# EAGLE design ui (EAGLE 9.6.2)
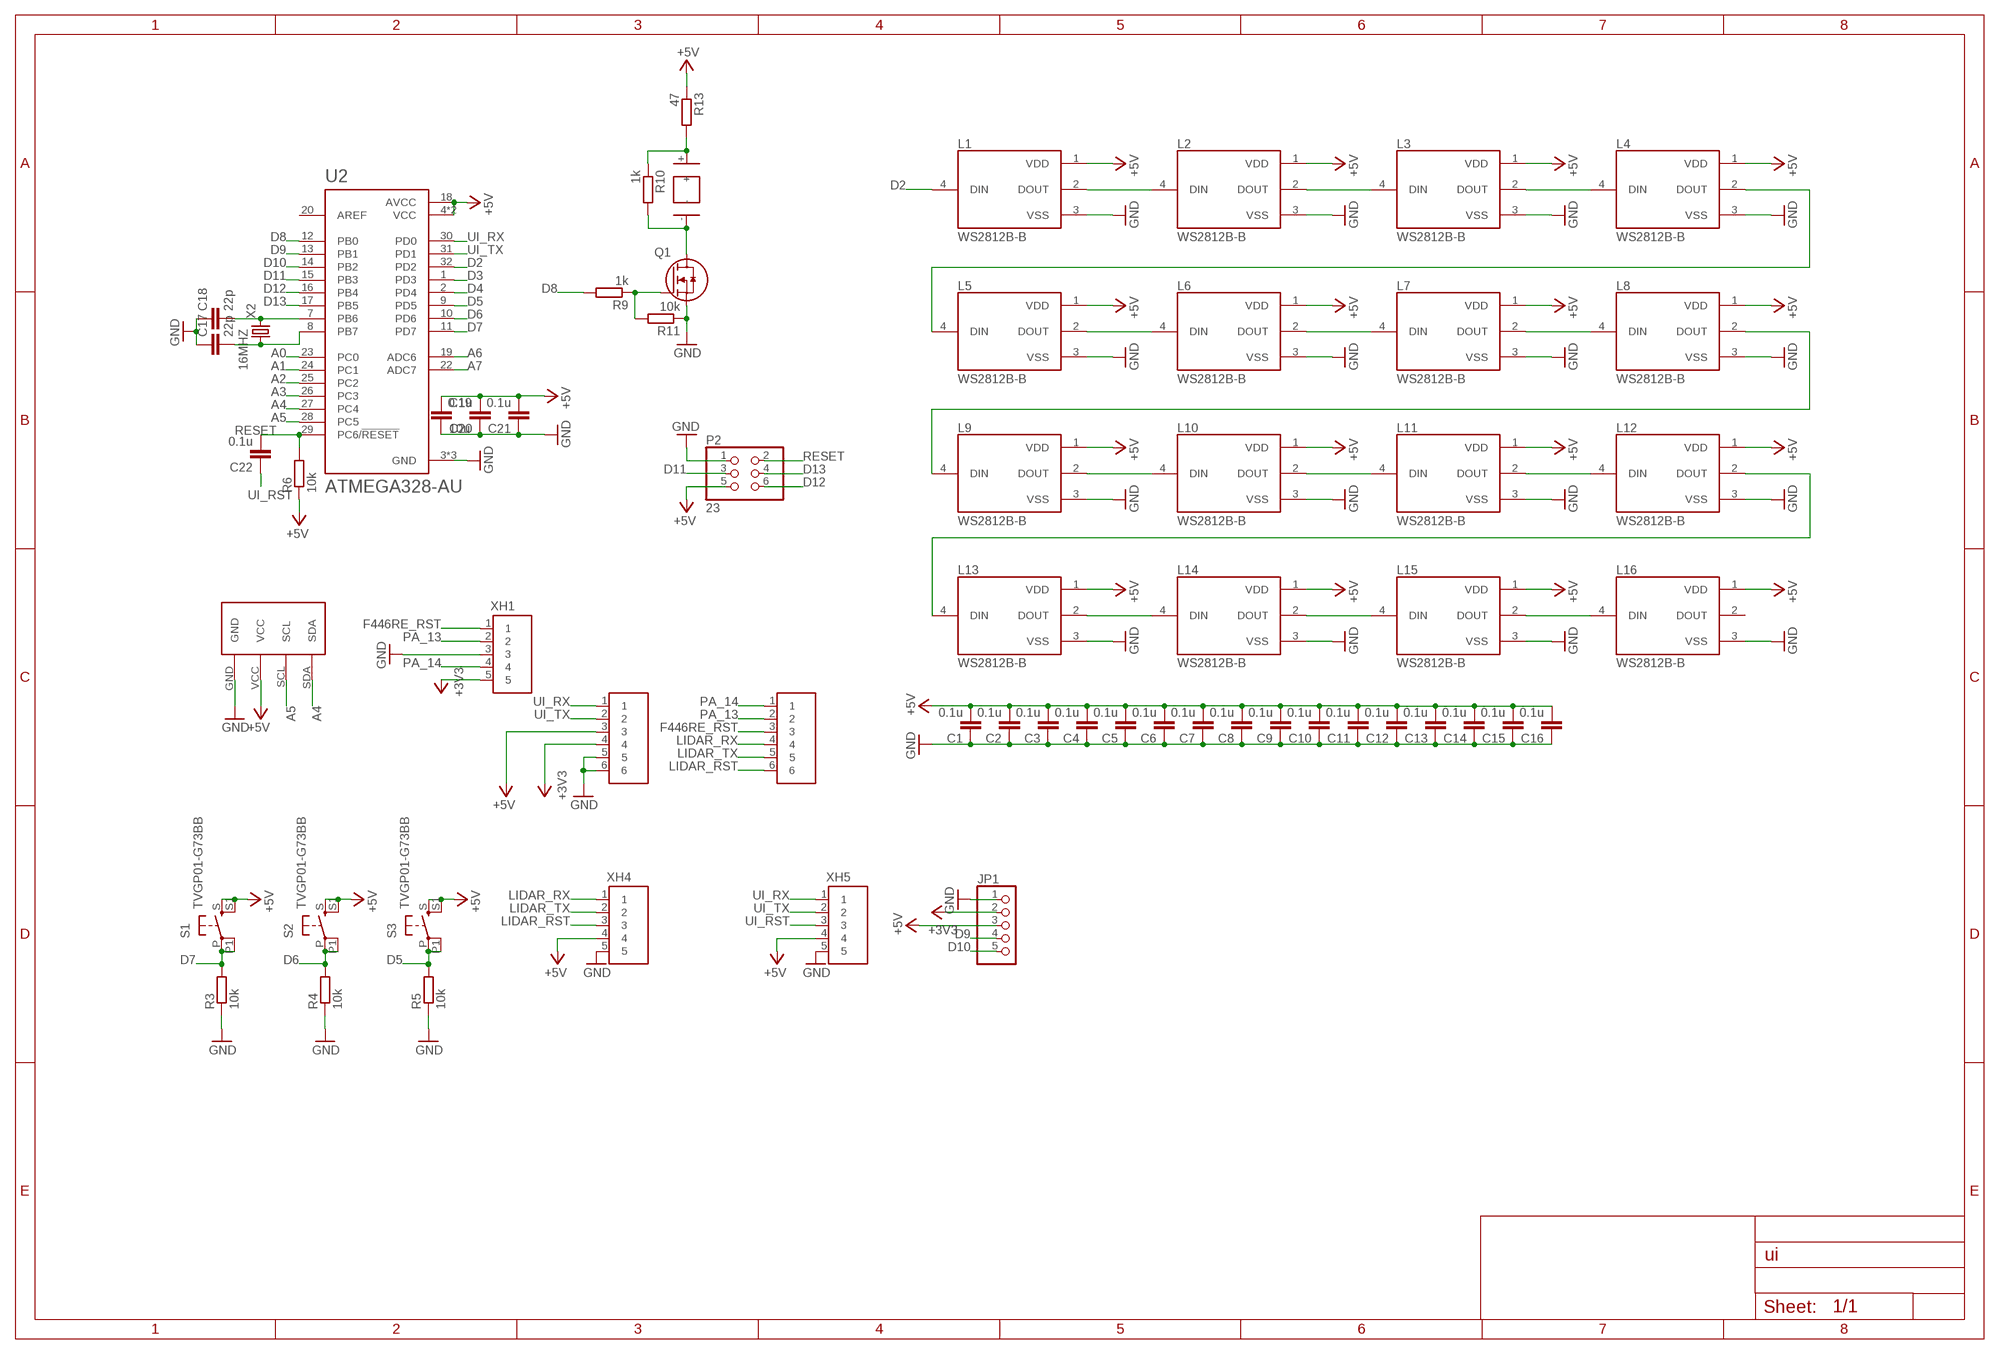
[diagram p0: schematic, sheet 1]

## Parts
B1  PKLCS1212E4001-R1  [PKLCS1212E4001-R1]
C1  0.1u  C-EUC0603  [C0603]
C2  0.1u  C-EUC0603  [C0603]
C3  0.1u  C-EUC0603  [C0603]
C4  0.1u  C-EUC0603  [C0603]
C5  0.1u  C-EUC0603  [C0603]
C6  0.1u  C-EUC0603  [C0603]
C7  0.1u  C-EUC0603  [C0603]
C8  0.1u  C-EUC0603  [C0603]
C9  0.1u  C-EUC0603  [C0603]
C10  0.1u  C-EUC0603  [C0603]
C11  0.1u  C-EUC0603  [C0603]
C12  0.1u  C-EUC0603  [C0603]
C13  0.1u  C-EUC0603  [C0603]
C14  0.1u  C-EUC0603  [C0603]
C15  0.1u  C-EUC0603  [C0603]
C16  0.1u  C-EUC0603  [C0603]
C17  22p  C-EUC0603  [C0603]
C18  22p  C-EUC0603  [C0603]
C19  10u  C-EUC0805  [C0805]
C20  0.1u  C-EUC0603  [C0603]
C21  0.1u  C-EUC0603  [C0603]
C22  0.1u  C-EUC0603  [C0603]
JP1  PINHD-1X5  [1X05]
L1  WS2812B-B  [LED_WS2812B-B]
L2  WS2812B-B  [LED_WS2812B-B]
L3  WS2812B-B  [LED_WS2812B-B]
L4  WS2812B-B  [LED_WS2812B-B]
L5  WS2812B-B  [LED_WS2812B-B]
L6  WS2812B-B  [LED_WS2812B-B]
L7  WS2812B-B  [LED_WS2812B-B]
L8  WS2812B-B  [LED_WS2812B-B]
L9  WS2812B-B  [LED_WS2812B-B]
L10  WS2812B-B  [LED_WS2812B-B]
L11  WS2812B-B  [LED_WS2812B-B]
L12  WS2812B-B  [LED_WS2812B-B]
L13  WS2812B-B  [LED_WS2812B-B]
L14  WS2812B-B  [LED_WS2812B-B]
L15  WS2812B-B  [LED_WS2812B-B]
L16  WS2812B-B  [LED_WS2812B-B]
P2  23  [2*3]
Q1  NP52N06SLG  [TO230P1040X230-3N]
R3  10k  R-EU_0204/5  [0204/5]
R4  10k  R-EU_0204/5  [0204/5]
R5  10k  R-EU_0204/5  [0204/5]
R6  10k  R-EU_0204/5  [0204/5]
R9  1k  R-EU_0204/5  [0204/5]
R10  1k  R-EU_0204/5  [0204/5]
R11  10k  R-EU_0204/5  [0204/5]
R13  47  R-EU_0204/5  [0204/5]
S1  TVGP01-G73BB  [TVGP01-G73BB]
S2  TVGP01-G73BB  [TVGP01-G73BB]
S3  TVGP01-G73BB  [TVGP01-G73BB]
U1  SSD1306  [SSD1306]
U2  ATMEGA328-AU  [QFP80P900X900X120-32N]
X2  16MHZ  [16MHZ]
XH1  S5B  [S5B]
XH2  S6B  [S6B]
XH3  S6B  [S6B]
XH4  S5B  [S5B]
XH5  S5B  [S5B]

## Nets
+3V3: JP1.2 XH1.5 XH2.4
+5V: C1.2 C2.2 C3.2 C4.2 C5.2 C6.2 C7.2 C8.2 C9.2 C10.2 C11.2 C12.2 C13.2 C14.2 C15.2 C16.2 C19.1 C20.2 C21.2 JP1.3 L1.1(VDD) L2.1(VDD) L3.1(VDD) L4.1(VDD) L5.1(VDD) L6.1(VDD) L7.1(VDD) L8.1(VDD) L9.1(VDD) L10.1(VDD) L11.1(VDD) L12.1(VDD) L13.1(VDD) L14.1(VDD) L15.1(VDD) L16.1(VDD) P2.5 R6.1 R13.1 S1.S S1.S1 S2.S S2.S1 S3.S S3.S1 U1.VCC U2.4(VCC) U2.6(VCC) U2.18(AVCC) XH2.3 XH4.4 XH5.4
A0: U2.23(PC0)
A1: U2.24(PC1)
A2: U2.25(PC2)
A3: U2.26(PC3)
A4: U1.SDA U2.27(PC4)
A5: U1.SCL U2.28(PC5)
A6: U2.19(ADC6)
A7: U2.22(ADC7)
D2: L1.4(DIN) U2.32(PD2)
D3: U2.1(PD3)
D4: U2.2(PD4)
D5: R5.2 S3.P S3.P1 U2.9(PD5)
D6: R4.2 S2.P S2.P1 U2.10(PD6)
D7: R3.2 S1.P S1.P1 U2.11(PD7)
D8: R9.2 U2.12(PB0)
D9: JP1.4 U2.13(PB1)
D10: JP1.5 U2.14(PB2)
D11: P2.3 U2.15(PB3)
D12: P2.6 U2.16(PB4)
D13: P2.4 U2.17(PB5)
F446RE_RST: XH1.1 XH3.3
GND: C1.1 C2.1 C3.1 C4.1 C5.1 C6.1 C7.1 C8.1 C9.1 C10.1 C11.1 C12.1 C13.1 C14.1 C15.1 C16.1 C17.1 C18.1 C19.2 C20.1 C21.1 JP1.1 L1.3(VSS) L2.3(VSS) L3.3(VSS) L4.3(VSS) L5.3(VSS) L6.3(VSS) L7.3(VSS) L8.3(VSS) L9.3(VSS) L10.3(VSS) L11.3(VSS) L12.3(VSS) L13.3(VSS) L14.3(VSS) L15.3(VSS) L16.3(VSS) P2.1 Q1.S R3.1 R4.1 R5.1 R11.1 U1.GND U2.3(GND) U2.5(GND) U2.21(GND) XH1.3 XH2.5 XH2.6 XH4.5 XH5.5
LIDAR_RST: XH3.6 XH4.3
LIDAR_RX: XH3.4 XH4.1
LIDAR_TX: XH3.5 XH4.2
N$1: C18.2 U2.7(PB6) X2.P$2
N$2: C17.2 U2.8(PB7) X2.P$1
N$3: B1.- Q1.D R10.2
N$4: L1.2(DOUT) L2.4(DIN)
N$5: L2.2(DOUT) L3.4(DIN)
N$6: L3.2(DOUT) L4.4(DIN)
N$7: L4.2(DOUT) L5.4(DIN)
N$8: L5.2(DOUT) L6.4(DIN)
N$9: L6.2(DOUT) L7.4(DIN)
N$10: L7.2(DOUT) L8.4(DIN)
N$11: L8.2(DOUT) L9.4(DIN)
N$12: Q1.G R9.1 R11.2
N$13: L9.2(DOUT) L10.4(DIN)
N$14: L10.2(DOUT) L11.4(DIN)
N$15: L11.2(DOUT) L12.4(DIN)
N$16: L12.2(DOUT) L13.4(DIN)
N$17: L13.2(DOUT) L14.4(DIN)
N$18: L14.2(DOUT) L15.4(DIN)
N$19: L15.2(DOUT) L16.4(DIN)
N$20: B1.+ R10.1 R13.2
PA_13: XH1.2 XH3.2
PA_14: XH1.4 XH3.1
RESET: C22.2 P2.2 R6.2 U2.29(PC6/!RESET)
UI_RST: C22.1 XH5.3
UI_RX: U2.30(PD0) XH2.1 XH5.1
UI_TX: U2.31(PD1) XH2.2 XH5.2
Unconnected: L16.2(DOUT) U2.20(AREF)

## Library data of the parts
B1 = buzzer:PKLCS1212E4001-R1
C1-C22 = rcl:C-EU: CAPACITOR, European symbol; SPICEPREFIX: C
JP1 = pinhead:PINHD-1X5: PIN HEADER
L1-L16 = WS2812B-B:WS2812B-B: Intelligent control LED integrated light source Check availability <https://pricing.snapeda.com/parts/WS2812B-B/Worldsemi/view-part?ref=eda>; AVAILABILITY: Not in stock; DESCRIPTION: Intelligent control LED integrated light source; MF: Worldsemi; MP: WS2812B-B; PACKAGE: Package; PRICE: None
P2 = pin_socket:2*3
Q1 = TO230P1040X230-3N:NP52N06SLG
R3-R6 R9-R11 R13 = rcl:R-EU_: RESISTOR, European symbol; SPICEPREFIX: R
S1-S3 = switch:TVGP01-G73BB
U1 = SSD1306:SSD1306
U2 = ATMEGA328-AU:ATMEGA328-AU: ATmega Series 20 MHz 32 KB Flash 2 KB SRAM 8-Bit Microcontroller - TQFP-32 Check availability <https://pricing.snapeda.com/parts/ATMEGA328-AU/Microchip/view-part?ref=eda>; AVAILABILITY: In Stock; DESCRIPTION: AVR AVR® ATmega Microcontroller IC 8-Bit 20MHz 32KB (16K x 16) FLASH 32-TQFP (7x7); MF: Microchip; MP: ATMEGA328-AU; PACKAGE: TQFP-32 Microchip; PRICE: None; PURCHASE-URL: https://pricing.snapeda.com/search/part/ATMEGA328-AU/?ref=eda
X2 = crystal:16MHZ
XH1 XH4 XH5 = XH:S5B
XH2 XH3 = XH:S6B

## Board
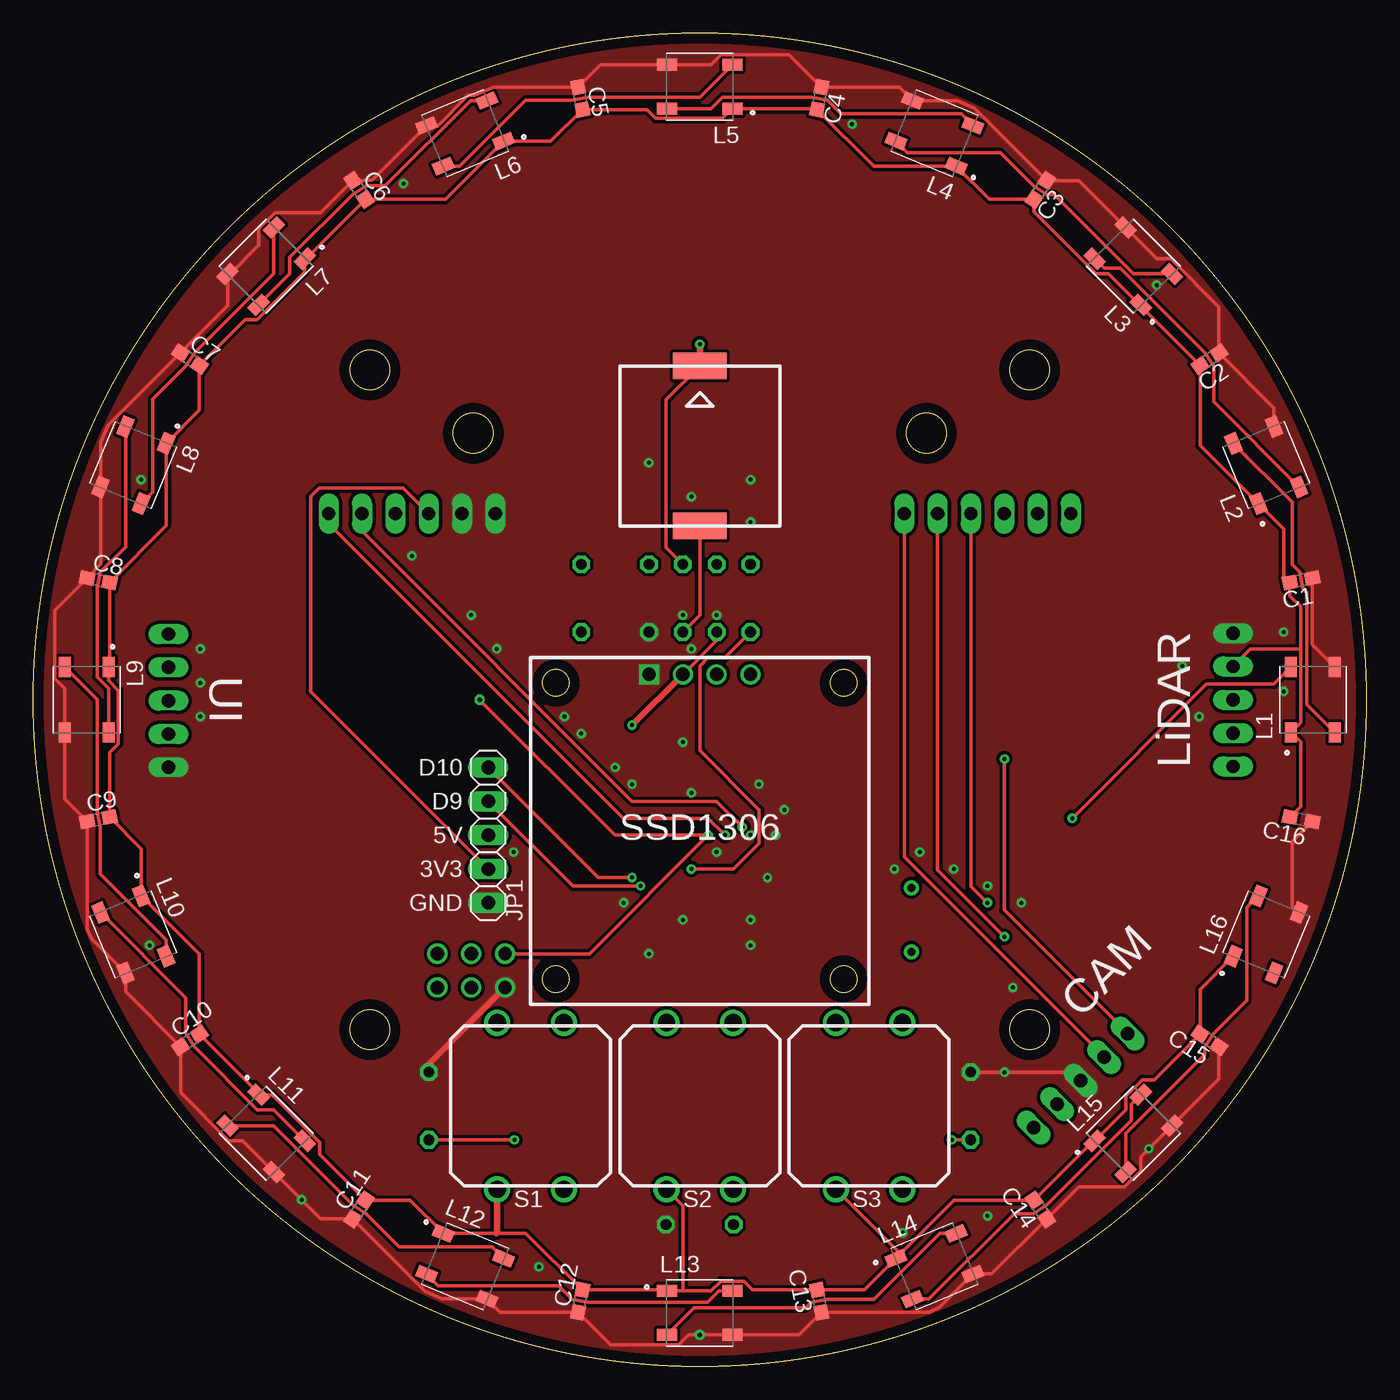
[diagram p1: board, top side]
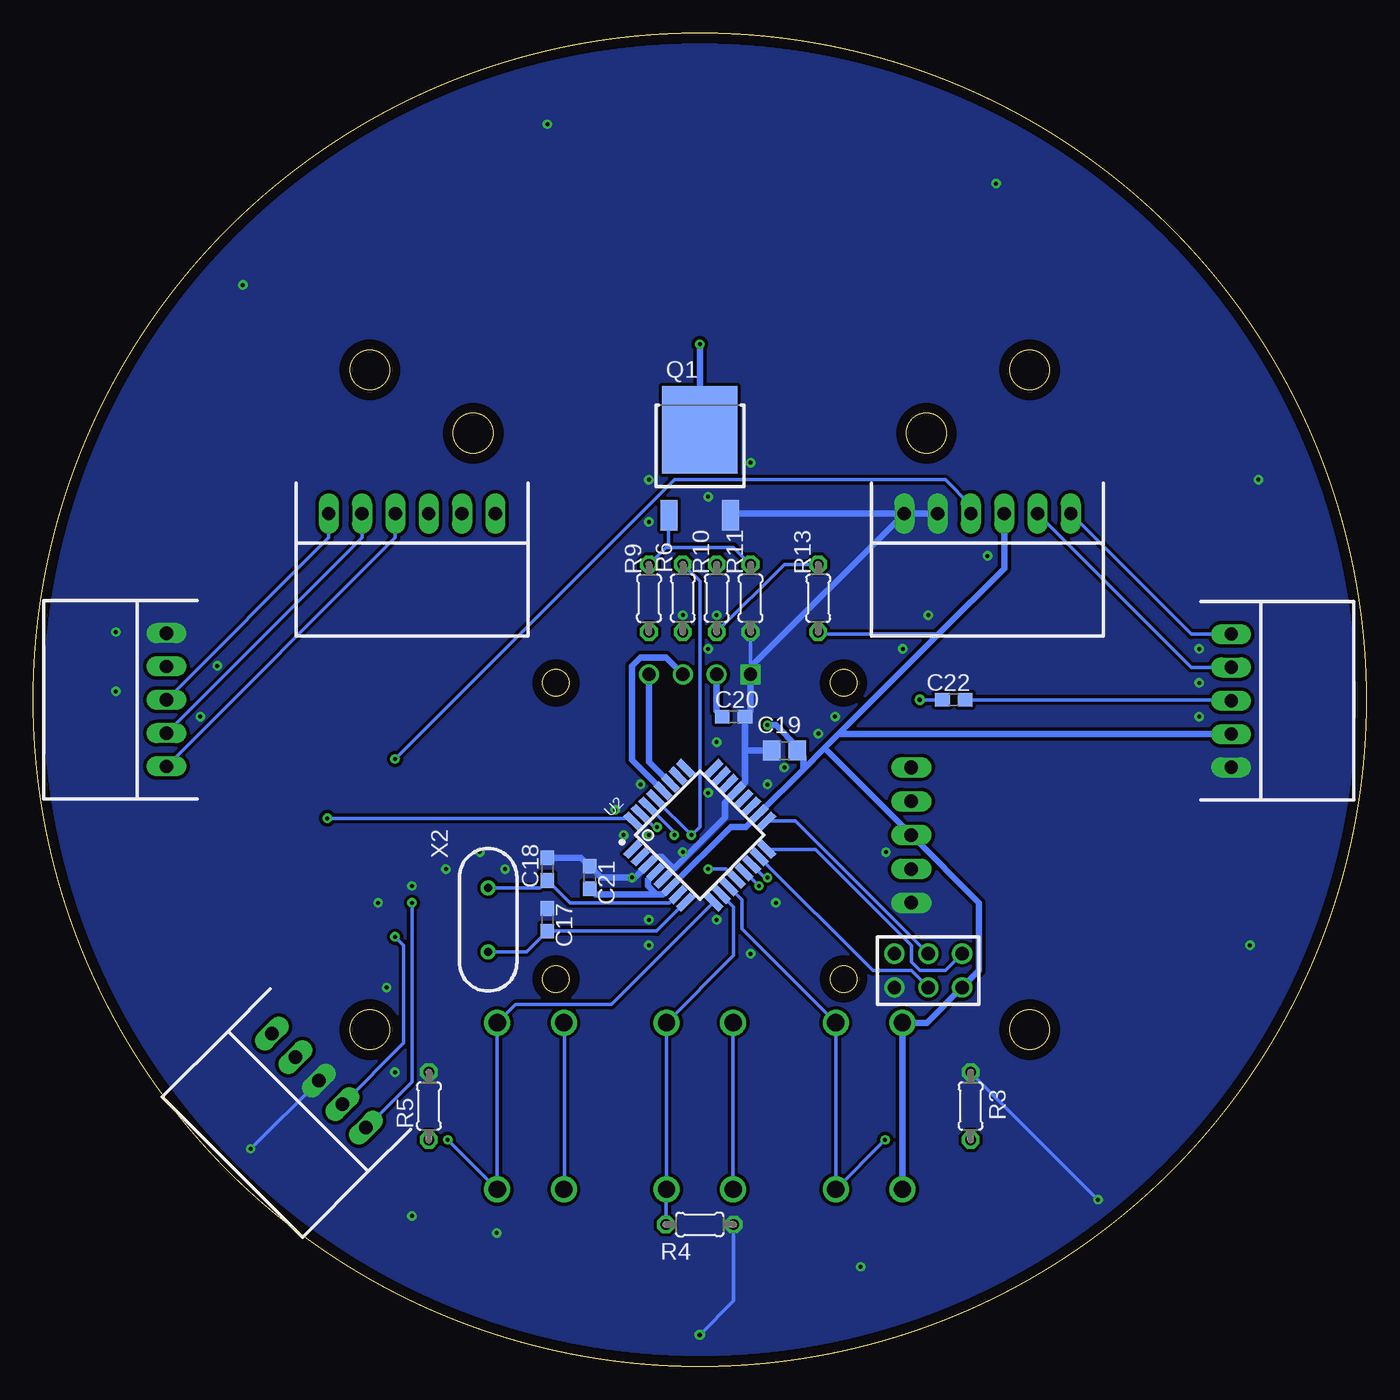
[diagram p2: board, bottom side, seen from below]

Size 100 x 100 mm. Coordinates in mm from the lower left corner, seen from the top.
Outline: circle at 33,70 radius 1.5
Outline: circle at 67,70 radius 1.5
Outline: circle at 50,50 radius 50
Outline: circle at 74.75,74.75 radius 1.5
Outline: circle at 74.75,25.25 radius 1.5
Outline: circle at 25.25,74.75 radius 1.5
Outline: circle at 25.25,25.25 radius 1.5
Copper layers (1*16): Top 0.035mm / dielectric 1.5mm / Bottom 0.035mm
Design rules "default *": minimum track width 6mil, minimum drill 0.3mm, track to track 6mil, track to pad 6mil, pad to pad 6mil, via to via 6mil, smd to smd 6mil, copper to edge 30mil, drill to drill 6mil, minimum pad ring 10mil, minimum via ring 8mil, stop-mask expansion 4mil, vias tented up to drill 0mil, thermal gap 10mil

### Footprints (pad centres in the part's own frame; a part is rotated, then mirrored left to right if it is on the bottom)
PKLCS1212E4001-R1 = smd 2 x 4: + -6,0; - 6,0
C0603 = smd 1.1 x 1: 1 -0.85,0; 2 0.85,0
C0805 = smd 1.3 x 1.5: 1 -0.95,0; 2 0.95,0
1X05 = drill 1.016 long: 1 -5.08,0; 2 -2.54,0; 3 0,0; 4 2.54,0; 5 5.08,0
LED_WS2812B-B = smd 1.5 x 0.9: 1 -2.45,1.65; 2 -2.45,-1.65; 3 2.45,-1.65; 4 2.45,1.65
2*3 = drill 1: 1 -1.27,2.54; 2 1.27,2.54; 3 -1.27,0; 4 1.27,0; 5 -1.27,-2.54; 6 1.27,-2.54
TO230P1040X230-3N = smd 5.67 x 6.59: D 0,1.2 | smd 1.28 x 2.3: G -2.3,-5.2; S 2.3,-5.2
0204/5 = drill 0.813 octagon: 1 -2.54,0; 2 2.54,0
TVGP01-G73BB = drill 1.3: P 2.5,6.25; P1 2.5,-6.25; S -2.5,6.25; S1 -2.5,-6.25
SSD1306 = drill 1 square: GND -3.81,0 | drill 1: SCL 1.27,0; SDA 3.81,0; VCC -1.27,0
QFP80P900X900X120-32N = smd 1.5 x 0.55: 1 -4.3,2.8; 2 -4.3,2; 3 -4.3,1.2; 4 -4.3,0.4; 5 -4.3,-0.4; 6 -4.3,-1.2; 7 -4.3,-2; 8 -4.3,-2.8; 17 4.3,-2.8; 18 4.3,-2; 19 4.3,-1.2; 20 4.3,-0.4; 21 4.3,0.4; 22 4.3,1.2; 23 4.3,2; 24 4.3,2.8 | smd 0.55 x 1.5: 9 -2.8,-4.3; 10 -2,-4.3; 11 -1.2,-4.3; 12 -0.4,-4.3; 13 0.4,-4.3; 14 1.2,-4.3; 15 2,-4.3; 16 2.8,-4.3; 25 2.8,4.3; 26 2,4.3; 27 1.2,4.3; 28 0.4,4.3; 29 -0.4,4.3; 30 -1.2,4.3; 31 -2,4.3; 32 -2.8,4.3
16MHZ = drill 0.6: P$1 -2.4,0; P$2 2.4,0
S5B = drill 1 long: 1 0,5; 2 0,2.5; 3 0,0; 4 0,-2.5; 5 0,-5
S6B = drill 1 long: 1 0,6.25; 2 0,3.75; 3 0,1.25; 4 0,-1.25; 5 0,-3.75; 6 0,-6.25

### Placement (x,y rotation side)
B1  50,69.05 90 top
C1  95.12,58.97 191.3 top
C2  88.25,75.56 213.8 top
C3  75.56,88.25 236.3 top
C4  58.97,95.12 258.8 top
C5  41.03,95.12 281.3 top
C6  24.44,88.25 303.8 top
C7  11.75,75.56 326.3 top
C8  4.88,58.97 348.8 top
C9  4.88,41.03 11.3 top
C10  11.75,24.44 33.8 top
C11  24.44,11.75 56.3 top
C12  41.03,4.88 78.8 top
C13  58.97,4.88 101.3 top
C14  75.56,11.75 123.8 top
C15  88.25,24.44 146.3 top
C16  95.12,41.03 168.8 top
C17  61.43,33.49 270 bottom
C18  61.43,37.3 270 bottom
C19  43.65,46.19 180 bottom
C20  47.46,48.73 180 bottom
C21  58.26,36.66 270 bottom
C22  30.95,50 180 bottom
JP1  34.12,39.84 90 top
L1  96,50 90 top
L2  92.5,67.6 112.5 top
L3  82.53,82.53 135 top
L4  67.6,92.5 157.5 top
L5  50,96 180 top
L6  32.4,92.5 202.5 top
L7  17.47,82.53 225 top
L8  7.5,67.6 247.5 top
L9  4,50 270 top
L10  7.5,32.4 292.5 top
L11  17.47,17.47 315 top
L12  32.4,7.5 337.5 top
L13  50,4 0 top
L14  67.6,7.5 22.5 top
L15  82.53,17.47 45 top
L16  92.5,32.4 67.5 top
P2  32.86,29.68 90 bottom
Q1  50,69.05 0 bottom
R3  29.68,19.52 270 bottom
R4  50,10.63 180 bottom
R5  70.32,19.52 270 bottom
R6  51.27,57.62 90 bottom
R9  53.81,57.62 270 bottom
R10  48.73,57.62 90 bottom
R11  46.19,57.62 90 bottom
R13  41.11,57.62 90 bottom
S1  37.3,19.52 0 top
S2  50,19.52 0 top
S3  62.7,19.52 0 top
U1  50,51.91 0 top
U2  50,39.84 45 bottom
X2  65.88,33.49 90 bottom
XH1  78.58,21.43 225 bottom
XH2  28.41,63.97 270 bottom
XH3  71.59,63.97 270 bottom
XH4  90,50 180 bottom
XH5  10.12,49.93 0 bottom

### Tracks (layer width: path | path; a pad name or v marks a point on that pad's centre or on a via)
+3V3  (via drill 0.3)
  Top 0.25: XH1.5 72.86,34.22 v72.86,45.55 | XH2.4 27.75,65.88 21.43,65.88 20.79,65.24 20.79,50.63 JP1.2
  Bottom 0.25: v72.86,45.55 51.91,66.51 31.59,66.51 29.66,64.59 XH2.4
+5V  (via drill 0.3)
  Top 0.25: L3.1 83.09,79.53 | 83.09,79.53 C2.2 87.54,69.08 L2.1 93.81,62.8 93.81,59.27 C1.2 94.28,57.79 95.09,56.98 95.09,53.81 | 83.09,79.53 80.66,81.97 79.72,81.97 75.09,86.61 C3.2 71.73,87.54 L4.1 63.05,90.04 C4.2 58.74,94.35 L5.1 51.72,93.62 46.69,93.62 46.02,94.28 C5.2 38.82,91.91 L6.1 30.92,87.54 C6.2 20.47,83.09 L7.1 20.37,82.06 16.81,78.5 15.88,78.5 C7.2 12.46,71.73 L8.1 9.96,63.05 C8.2 5.72,52.52 L9.1 5.65,51.43 6.38,50.7 6.38,46.69 5.72,46.02 C9.2 8.09,38.82 L10.1 12.46,30.92 C10.2 16.91,20.47 L11.1 17.94,20.37 21.5,16.81 21.5,15.88 C11.2 28.27,12.46 L12.1 34.76,9.96 36.95,9.96 C12.2 47.48,5.72 L13.1 48.73,5.65 | 48.73,5.65 50.86,5.65 51.59,6.38 53.31,6.38 53.98,5.72 C13.2 62.34,5.72 L14.1 64.97,8.35 | 64.97,8.35 69.08,12.46 C14.2 79.53,16.91 L15.1 81.97,19.25 81.97,20.27 83.19,21.5 84.12,21.5 C15.2 87.54,28.27 L16.1 | C16.2 95.09,41.99 95.09,46.81 L1.1 95.09,48.28 95.09,53.81 | S3.S1 64.97,8.49 64.97,8.35 | S2.S1 48.73,12.04 48.73,5.65 | R6.1 51.27,54.45 U1.VCC | XH4.4 91.31,53.81 95.09,53.81
  Top 0.5: v44.92,48.09 U1.VCC | S1.S1 34.8,10 34.76,9.96
  Bottom 0.25: S2.S1 S2.S | S3.S1 60.16,13.31 60.16,25.73 S3.S | R13.1 40.97,54.94 32.08,54.94
  Bottom 0.5: C20.2 48.73,49.15 U1.VCC | 42.24,44.78 U2.18 46.54,40.48 47.67,40.48 U2.6 52.75,35.39 53.26,35.39 | 53.26,35.39 53.88,36.01 53.88,36.52 U2.4 | 53.26,35.39 57.83,35.39 C21.2 | v44.92,48.09 44.28,48.09 42.7,46.51 C19.1 42.24,45.73 42.24,44.78 | S1.S1 S1.S 32.95,25.77 P2.5 29.05,29.68 29.05,34.76 JP1.3 40.65,46.36 | XH2.3 27.16,59.85 32.08,54.94 39.58,47.43 | 39.58,47.43 40.65,46.36 | 40.65,46.36 42.24,44.78 | XH5.4 39.58,47.43
A4
  Bottom 0.5: U1.SDA 53.81,45.35 U2.27
A5
  Bottom 0.5: U1.SCL 52.54,53.17 54.45,53.17 55.08,52.54 55.08,45.49 U2.28
D2  (via drill 0.3)
  Top 0.25: v77.94,41.11 88.01,51.18 93.08,51.18 L1.4
  Bottom 0.25: U2.32 55.23,41.11 v77.94,41.11
D5  (via drill 0.3)
  Top 0.25: v68.91,16.98 R5.2
  Bottom 0.25: v68.91,16.98 S3.P1 S3.P 63.83,27.14 56.62,27.14 U2.9
D6
  Bottom 0.25: R4.2 52.54,13.23 S2.P1 S2.P 47.46,30.81 47.46,34.47 U2.10
D7  (via drill 0.3)
  Top 0.25: R3.2 v36.09,16.98
  Bottom 0.25: v36.09,16.98 S1.P1 S1.P 46.83,32.8 46.83,34.97 U2.11
D8  (via drill 0.3)
  Top 0.25: v49.37,37.3 52.54,37.3 54.45,39.2 54.45,41.74 50,46.19 50,52.54 50.63,53.17 51.91,53.17 R9.2
  Bottom 0.25: U2.12 48.03,37.3 v49.37,37.3
D9  (via drill 0.3)
  Top 0.25: JP1.4 40.48,36.03 v45.55,36.03
  Bottom 0.25: v45.55,36.03 46.61,37.08 U2.13
D10  (via drill 0.3)
  Top 0.25: v44.92,36.66 42.38,36.66 JP1.5
  Bottom 0.25: U2.14 45.13,36.66 v44.92,36.66
D11
  Bottom 0.25: P2.3 34.12,29.68 37.01,29.68 U2.15
D12
  Bottom 0.25: U2.16 41.32,38.78 34.12,31.59 34.12,30.32 33.49,29.68 31.59,29.68 P2.6
D13
  Bottom 0.25: P2.4 42.81,40.9 U2.17
F446RE_RST  (via drill 0.3)
  Top 0.25: v71.59,34.76 70.34,36.01 XH3.3
  Bottom 0.25: XH1.1 71.59,21.34 v71.59,34.76
GND  (via drill 0.3, 0.35)
  Top 0.25: C1.1 95.95,54.15 L1.3 | L2.3 93.09,71.9 C2.1 88.95,79.46 85.33,83.09 84.3,83.09 L3.3 78.43,88.95 C3.1 71.59,93.39 71.58,93.43 71.54,93.44 70.61,94.37 69.35,94.96 L4.3 64.98,95.95 C4.1 56.71,98.38 51.59,98.38 50.86,97.65 L5.3 42.56,97.65 C5.1 34.58,95.95 34.55,95.96 33.1,95.36 32.63,95.36 30.35,93.09 L6.3 25.41,89 24.82,89 24.78,88.95 C6.1 21.57,86.55 18.14,86.55 16.91,85.33 16.91,84.09 14.57,81.75 | L7.3 14.57,81.75 | 14.57,81.75 14.57,79.56 C7.1 6.61,71.59 6.57,71.58 6.56,71.54 5.63,70.61 5.04,69.35 L8.3 5.04,60.19 4.62,59.77 4.62,59.71 C8.1 1.62,56.71 1.62,51.59 2.35,50.86 L9.3 2.35,42.56 C9.1 4.05,34.58 4.04,34.55 4.05,34.52 4.05,32.77 4.41,32.01 L10.3 6.91,28.1 C10.1 11.05,20.54 14.67,16.91 15.7,16.91 L11.3 v20.12,12.5 21.57,11.05 C11.1 28.41,6.61 28.42,6.57 28.46,6.56 29.39,5.63 30.65,5.04 L12.3 35.02,4.05 C12.1 43.29,1.62 48.41,1.62 49.14,2.35 v50,2.35 L13.3 57.44,2.35 C13.1 | C13.1 | C13.1 65.44,4.04 65.45,4.04 65.46,4.04 67.21,4.04 67.99,4.41 L14.3 71.9,6.91 C14.1 78.43,13.45 81.86,13.45 83.09,14.67 83.09,15.7 v83.69,16.31 L15.3 88.95,21.57 C15.1 | L16.3 94.45,34.54 94.45,39.36 C16.1 | R5.1 77.94,22.06 XH1.3
  Top 0.5: R3.1 29.68,22.7 P2.1
  Bottom 0.25: XH1.3 v83.69,16.31 | R3.1 v20.12,12.5 | R4.1 47.46,4.89 v50,2.35 | R11.1 46.19,52.44
  Bottom 0.5: 46.61,46.19 46.61,43.8 U2.21 48.09,42.31 48.09,41.18 U2.5 52.2,37.08 52.2,37.59 52.82,38.21 53.33,38.21 U2.3 54.87,36.66 57.41,36.66 C21.1 58.89,38.15 C18.1 | 46.61,46.19 C20.1 46.19,49.15 U1.GND 46.19,52.44 XH2.6 | C19.2 46.61,46.19 | XH2.5 XH2.6 | Q1.S 47.58,63.97 XH2.6
  other vias: 49.37,43.02 53.81,39.84 55.08,36.66 55.72,39.84 53.81,33.49 53.81,31.59 44.92,43.65 48.73,46.83 43.65,44.92 56.35,41.74 46.19,30.95 48.73,33.49 46.19,67.78 53.81,66.51 49.37,65.24 53.81,63.34 48.73,56.35 51.27,56.35 49.37,53.81 34.76,53.81 41.11,47.46 39.84,48.73 32.86,56.35 28.41,60.8 8.09,66.51 8.73,31.59 37.94,7.45 71.59,11.27 84.29,81.11 61.43,93.18 27.77,88.73 66.51,38.57 69.05,37.3 71.59,36.03 65.24,9.99 54.45,43.65 74.13,34.76 87.47,48.73 86.19,52.54 93.81,55.08 93.81,50.63 64.61,37.3 73.5,28.41 72.86,22.06 12.53,51.27 12.53,48.73 12.53,53.81 51.27,38.57 44.28,34.76 36.03,38.57
  pour Top (isolate 0.25, no thermals): -2.07,104.61 103.34,104.61 103.34,-4.61 -2.07,-4.61
  pour Bottom (isolate 0.25, no thermals): -0.8,103.34 102.07,103.34 102.07,-9.69 -0.8,-9.69 -0.8,102.07
LIDAR_RST
  Bottom 0.25: XH3.6 77.84,62.16 XH4.3
LIDAR_RX
  Bottom 0.25: XH4.1 72.84,62.16 XH3.4
LIDAR_TX
  Bottom 0.25: XH4.2 75.34,62.16 XH3.5
N$1
  Bottom 0.25: U2.7 52.25,34.76 59.74,34.76 C18.2 61.99,35.89 X2.P$2
N$2
  Bottom 0.25: U2.8 53.24,32.64 C17.2 62.98,31.09 X2.P$1
N$3  (via drill 0.3)
  Top 0.25: R10.2 47.46,61.43 47.46,72.51 B1.-
  Top 0.5: B1.- v50,76.67
  Bottom 0.5: v50,76.67 Q1.D
N$4
  Top 0.25: L1.2 95.55,49.65 95.55,58.09 95.26,58.38 95.02,59.58 94.45,60.15 94.45,64.82 L2.4
N$5
  Top 0.25: L2.2 88.57,72.36 88.57,75.03 87.89,76.06 81.57,82.37 80.35,82.37 L3.4
N$6
  Top 0.25: L3.2 82.55,81.96 76.62,87.89 76.06,87.89 75.03,88.57 72.56,91.04 65.58,91.04 L4.4
N$7
  Top 0.25: L5.4 50.86,94.35 51.72,95.21 58.37,95.21 59.57,94.97 60.59,93.96 69.63,93.96 L4.2
N$8
  Top 0.25: L6.4 32,90.04 36.94,94.97 40.43,94.97 41.63,95.21 50.01,95.21 L5.2
N$9
  Top 0.25: L7.4 19.25,81.97 19.25,83.19 23.95,87.89 24.97,88.57 26.41,88.57 32.8,94.96 L6.2
N$10
  Top 0.25: L8.4 8.96,65.58 8.96,72.56 11.43,75.03 12.11,76.06 18.04,81.98 L7.2
N$11
  Top 0.25: L8.2 6.91,61.46 5.02,59.57 4.79,58.37 4.79,51.72 5.65,50.86 L9.4
N$12
  Bottom 0.25: Q1.G 52.36,63.79 52.36,61.61 52.54,61.43 | R9.1 52.54,61.43 | 52.54,61.43 47.46,61.43 R11.2
N$13
  Top 0.25: L10.4 9.96,32 5.03,36.94 5.03,40.43 4.79,41.63 4.79,50.01 L9.2
N$14
  Top 0.25: L10.2 11.43,27.64 11.43,24.97 12.11,23.95 16.81,19.25 18.03,19.25 L11.4
N$15
  Top 0.25: L12.4 34.42,8.96 27.44,8.96 24.97,11.43 23.95,12.11 18.02,18.04 L11.2
N$16
  Top 0.25: L13.4 51.43,5.65 50.56,4.79 41.63,4.79 40.43,5.02 39.41,6.04 30.37,6.04 L12.2
N$17
  Top 0.25: L13.2 49.58,4.38 57.97,4.38 58.37,4.79 59.57,5.03 63.06,5.03 68,9.96 L14.4
N$18
  Top 0.25: L15.4 82.37,19.65 82.37,18.43 76.06,12.11 75.03,11.43 73.59,11.43 67.2,5.04 L14.2
N$19
  Top 0.25: L15.2 81.96,17.45 87.89,23.38 87.89,23.95 88.57,24.97 91.04,27.44 91.04,34.42 L16.4
N$20
  Top 0.25: R10.1 50,56.35 B1.+
  Bottom 0.25: R13.2 43.65,60.16 R10.1
PA_13  (via drill 0.3)
  Top 0.25: XH3.2 67.84,37.24 v72.86,32.22
  Bottom 0.25: XH1.2 72.22,24.24 72.22,31.59 v72.86,32.22
PA_14
  Top 0.25: XH1.4 65.34,38.2 XH3.1
RESET  (via drill 0.3, 0.35)
  Top 0.25: v33.49,50 43.65,39.84 v50.63,39.84 41.74,30.95 P2.2
  Bottom 0.25: U2.29 53.32,42.53 v50.63,39.84 50,40.48 50,58.89 R6.2 | v33.49,50 C22.2
UI_RST
  Bottom 0.25: XH5.3 10.19,50 C22.1
UI_RX  (via drill 0.3)
  Top 0.25: v51.91,39.84 50.63,41.11 44.28,41.11 22.16,63.23 XH2.1
  Bottom 0.25: U2.30 51.91,40.05 v51.91,39.84 | XH5.1 13.12,54.93 XH2.1
UI_TX  (via drill 0.3)
  Top 0.25: XH2.2 24.66,62.64 44.92,42.38 51.27,42.38 v53.2,40.45
  Bottom 0.25: v53.2,40.45 53.44,40.45 U2.31 | XH5.2 13.12,52.43 XH2.2

### Text on the board
tPlace: UI | LiDAR | D10 | D9 | 5V | 3V3 | GND | CAM